# EAGLE design TOP_pcb_redonda_intento_taladros (EAGLE 9.6.2)
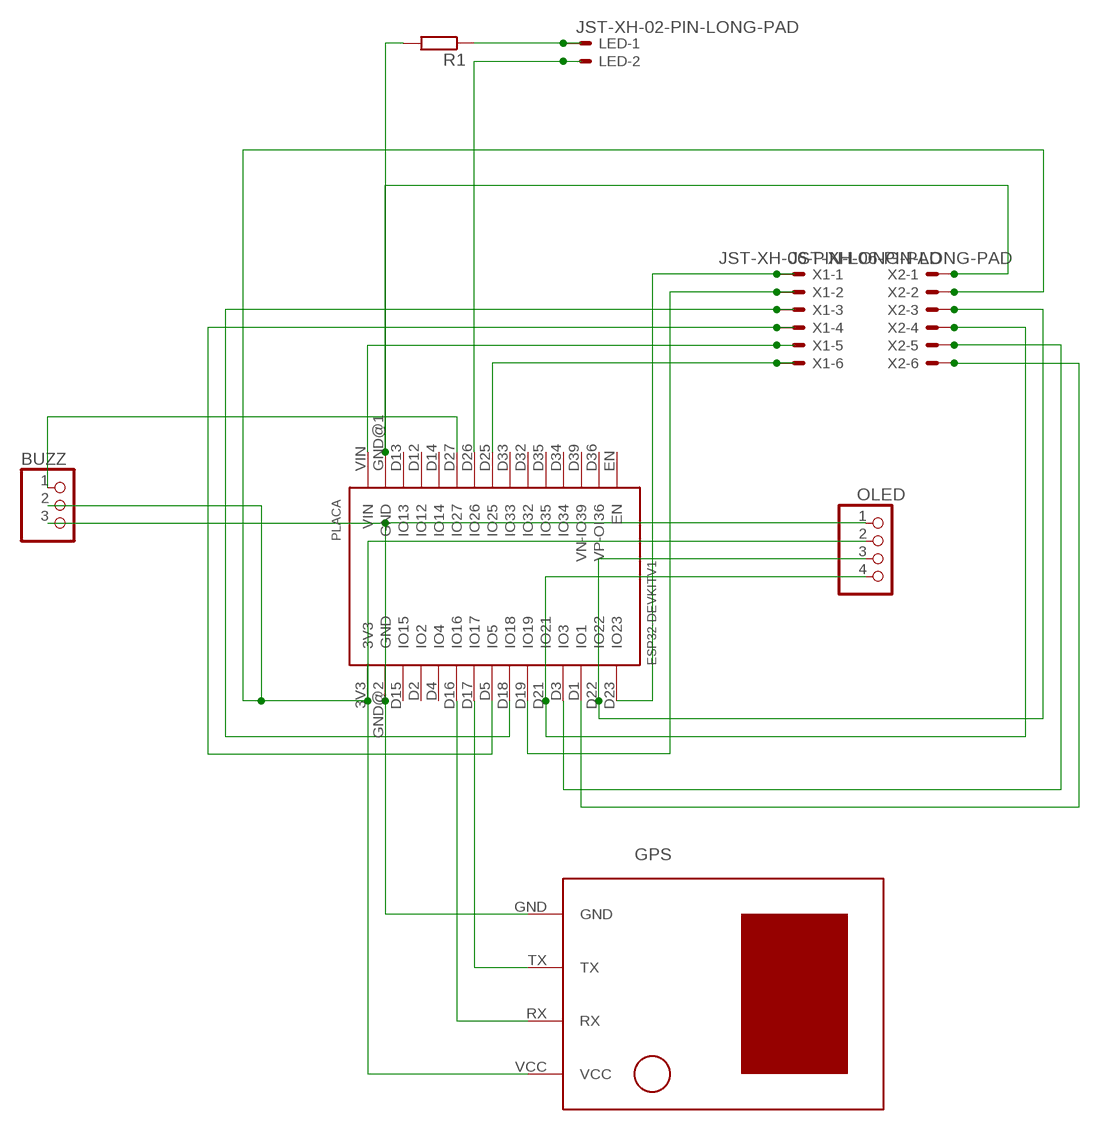
[diagram p0: schematic, sheet 1]

## Parts
BUZZ  PINHD-1X3  [1X03]
GPS  U-BLOX-NEO6V2  [U-BLOX-NEO6V2]
LED  JST-XH-02-PIN-LONG-PAD  [JST-XH-02-PACKAGE-LONG-PAD]
OLED  PINHD-1X4  [1X04]
PLACA  ESP32DEVKITV1  [ESP32-DEVKITV1]
R1  R-EU_0207/10  [0207/10]
X1  JST-XH-06-PIN-LONG-PAD  [JST-XH-06-PACKAGE-LONG-PAD]
X2  JST-XH-06-PIN-LONG-PAD  [JST-XH-06-PACKAGE-LONG-PAD]

## Nets
GPS: BUZZ.3 GPS.GND OLED.1 PLACA.GND@2(GND)
N$1: BUZZ.2 GPS.VCC OLED.2 PLACA.3V3 X2.2
N$2: PLACA.GND@1(GND) R1.2 X2.1
N$3: PLACA.VIN X1.5
N$4: OLED.3 PLACA.D22(IO22) X2.3
N$5: OLED.4 PLACA.D21(IO21) X2.4
N$6: PLACA.D3(IO3) X2.5
N$7: PLACA.D1(IO1) X2.6
N$8: GPS.RX PLACA.D16(IO16)
N$9: GPS.TX PLACA.D17(IO17)
N$10: PLACA.D25(IO25) X1.6
N$11: LED.2 PLACA.D26(IO26)
N$12: LED.1 R1.1
N$13: BUZZ.1 PLACA.D27(IO27)
N$14: PLACA.D23(IO23) X1.1
N$15: PLACA.D19(IO19) X1.2
N$16: PLACA.D18(IO18) X1.3
N$17: PLACA.D5(IO5) X1.4
Unconnected: PLACA.D2(IO2) PLACA.D4(IO4) PLACA.D12(IO12) PLACA.D13(IO13) PLACA.D14(IO14) PLACA.D15(IO15) PLACA.D32(IO32) PLACA.D33(IO33) PLACA.D34(IO34) PLACA.D35(IO35) PLACA.D36(VP-OI36) PLACA.D39(VN-IO39) PLACA.EN

## Library data of the parts
BUZZ = pinhead:PINHD-1X3: PIN HEADER
GPS = u-blox neo-6m v2:U-BLOX-NEO6V2
LED = Rembrandt Electronics - JST XH Connectors v1-0:JST-XH-02-PIN: JST XH Connector 2 Pin Wire to board connector. Pitch: 2,54 mm, (0.100") Number of pins: 2 Created by Rembrandt Electronics www.rembrandtelectronics.com
OLED = pinhead:PINHD-1X4: PIN HEADER
PLACA = ESP32-DEVKITV1:ESP32DEVKITV1
R1 = rcl:R-EU_: RESISTOR, European symbol; SPICEPREFIX: R
X1 X2 = Rembrandt Electronics - JST XH Connectors v1-0:JST-XH-06-PIN: JST XH Connector 2 Pin Wire to board connector. Pitch: 2,54 mm, (0.100") Number of pins: 6 Created by Rembrandt Electronics www.rembrandtelectronics.com

## Board
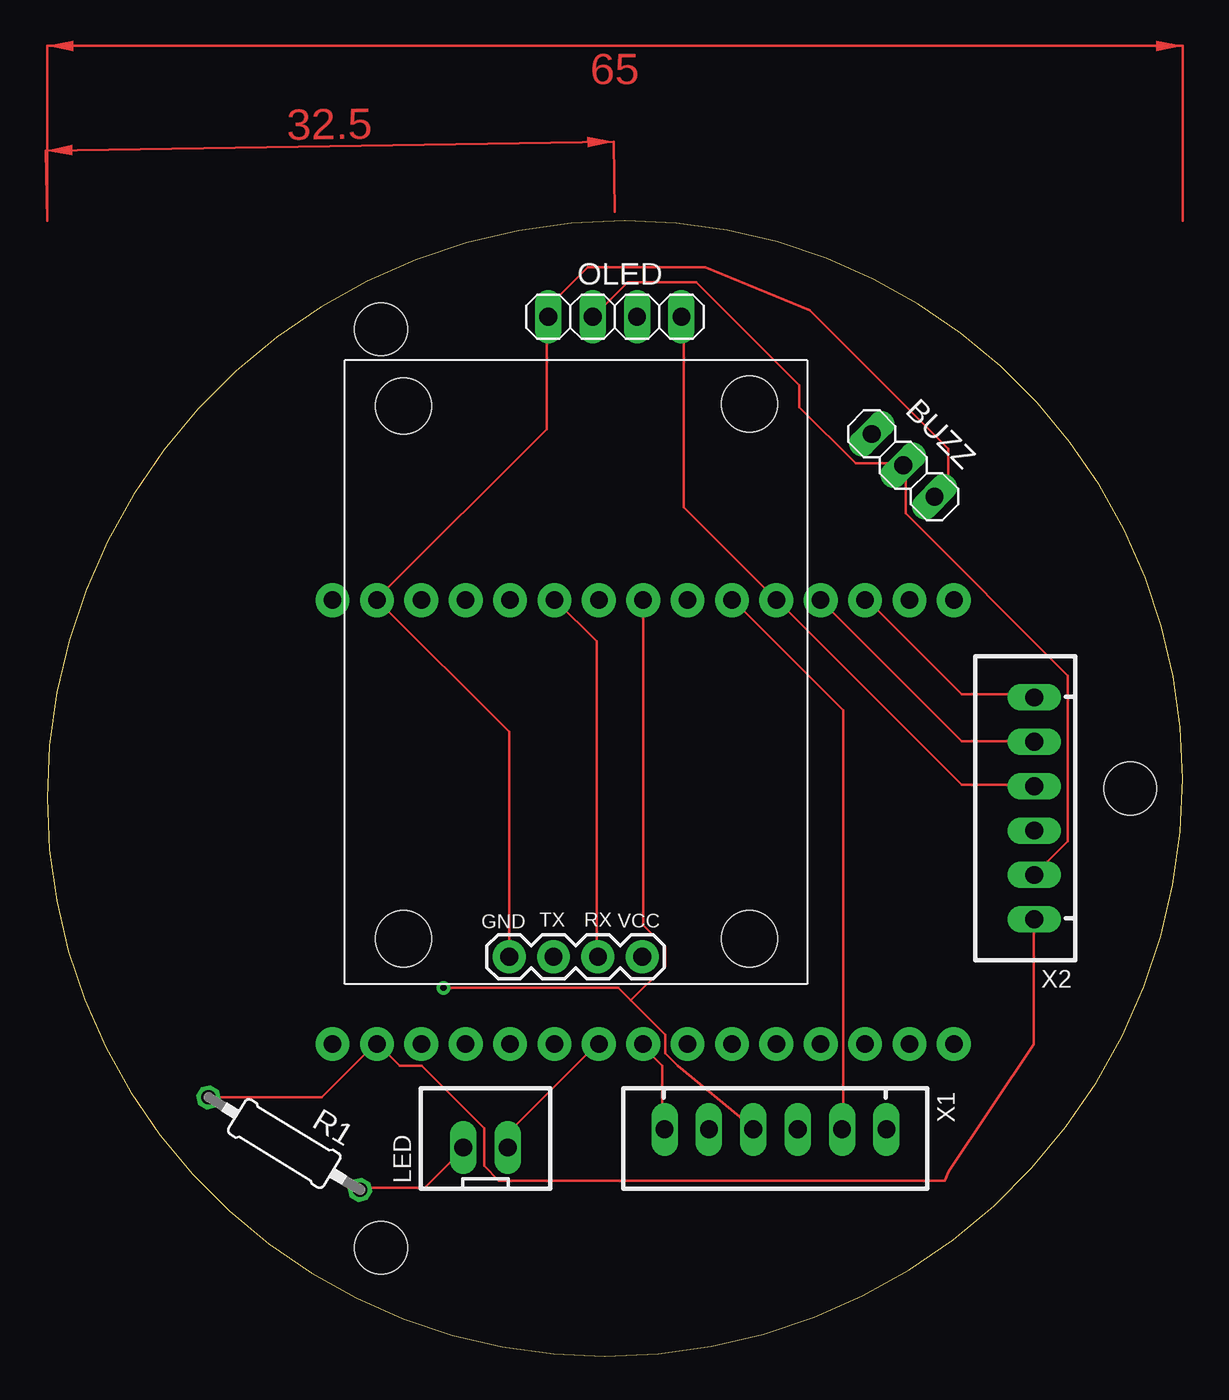
[diagram p1: board, top side]
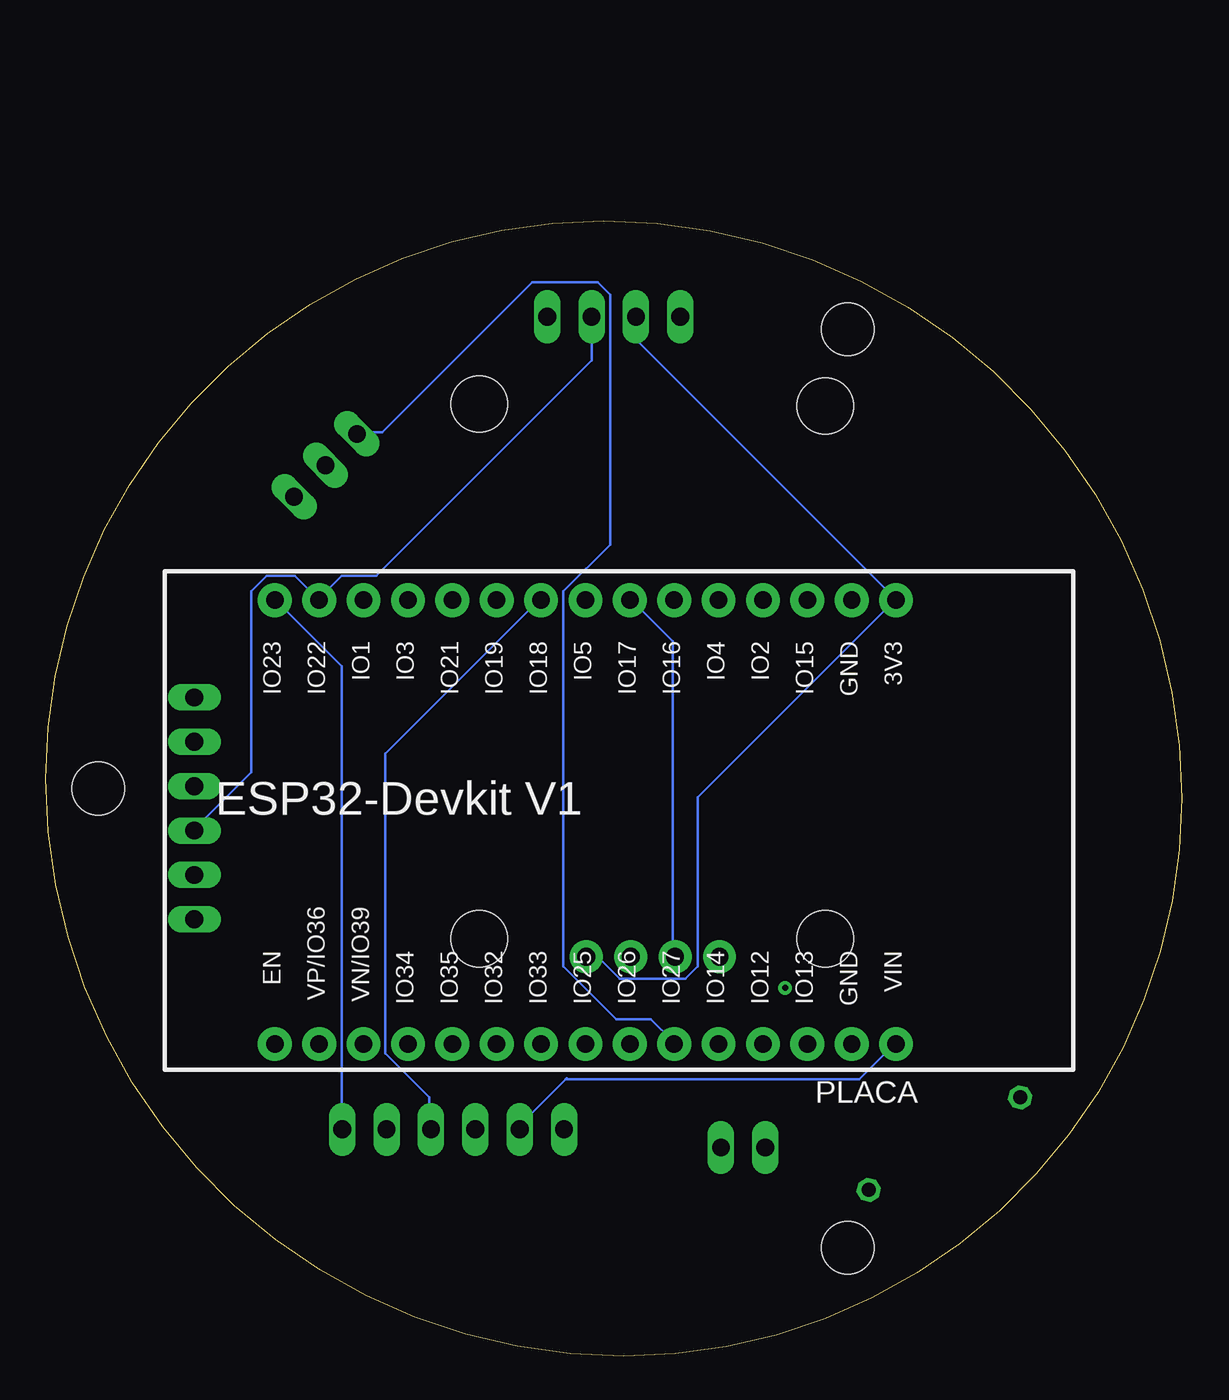
[diagram p2: board, bottom side, seen from below]

Size 65 x 65 mm. Coordinates in mm from the lower left corner, seen from the top.
Outline: 0,31.93 arc90 31.93,0 arc90 65,33.06 arc90 33.06,65 arc90 0,31.93
Copper layers (1*16): Top 0.035mm / dielectric 1.5mm / Bottom 0.035mm
Design rules "default": minimum track width 6mil, minimum drill 0.35mm, track to track 6mil, track to pad 6mil, pad to pad 6mil, via to via 6mil, smd to smd 6mil, copper to edge 40mil, drill to drill 6mil, minimum pad ring 10mil, minimum via ring 8mil, stop-mask expansion 4mil, vias tented up to drill 0mil, thermal gap 10mil
Holes 3 mm at 62,32.5 19.11,58.79 19.11,6.21

### Footprints (pad centres in the part's own frame; a part is rotated, then mirrored left to right if it is on the bottom)
1X03 = drill 1.016 long: 1 -2.54,0; 2 0,0; 3 2.54,0
U-BLOX-NEO6V2 = drill 1.016 pad 1.88: GND 17.05,34.13; RX 11.97,34.13; TX 14.51,34.13; VCC 9.43,34.13 | hole 3.2: 3.3,33.1; 23.1,33.1; 3.3,2.5; 23.1,2.6
JST-XH-02-PACKAGE-LONG-PAD = drill 1.016 long: 1 -1.27,0; 2 1.27,0
1X04 = drill 1.016 long: 1 -3.81,0; 2 -1.27,0; 3 1.27,0; 4 3.81,0
ESP32-DEVKITV1 = drill 1 pad 1.93: 3V3 -16.52,-12.27; D1 13.96,-12.27; D2 -8.9,-12.27; D3 11.42,-12.27; D4 -6.36,-12.27; D5 1.26,-12.27; D12 -8.9,13.135; D13 -11.44,13.135; D14 -6.36,13.135; D15 -11.44,-12.27; D16 -3.82,-12.27; D17 -1.28,-12.27; D18 3.8,-12.27; D19 6.34,-12.27; D21 8.88,-12.27; D22 16.5,-12.27; D23 19.04,-12.27; D25 1.26,13.135; D26 -1.28,13.135; D27 -3.82,13.135; D32 6.34,13.135; D33 3.8,13.135; D34 11.42,13.135; D35 8.88,13.135; D36 16.5,13.135; D39 13.96,13.135; EN 19.04,13.135; GND@1 -13.98,13.135; GND@2 -13.98,-12.27; VIN -16.52,13.135
0207/10 = drill 0.813 octagon: 1 -5.08,0; 2 5.08,0
JST-XH-06-PACKAGE-LONG-PAD = drill 1.016 long: 1 -6.35,0; 2 -3.81,0; 3 -1.27,0; 4 1.27,0; 5 3.81,0; 6 6.35,0

### Placement (x,y rotation side)
BUZZ  49,51 315 top
GPS  43.5,57 180 top
LED  25.1,11.95 0 top
OLED  32.5,59.5 0 top
PLACA  32.86,31.01 180 bottom
R1  13.58,12.17 148.6 top
X1  41.69,12.99 180 top
X2  56.51,31.36 90 top

### Tracks (layer width: path | path; a pad name or v marks a point on that pad's centre or on a via)
GPS
  Top 0.152: BUZZ.3 51.58,49.98 51.58,51.94 43.66,59.86 37.68,62.34 30.95,62.34 28.69,60.07 OLED.1 28.59,59.33 28.59,53.07 18.94,43.42 PLACA.GND@2 18.94,43.24 26.45,35.74 GPS.GND
N$1
  Top 0.152: OLED.2 31.27,59.51 33.24,61.47 37.17,61.47 43.07,55.58 43.07,54.33 46.28,51.11 48.96,51.11 BUZZ.2 49.14,50.93 49.14,48.25 58.44,38.96 58.44,29.48 56.65,27.7 X2.2
  Bottom 0.152: OLED.2 31.09,59.33 31.09,58.08 16.44,43.42 PLACA.3V3 16.44,43.24 27.7,31.99 27.7,22.34 28.41,21.62 32.17,21.62 33.24,22.7 33.95,22.7 GPS.VCC
N$2
  Top 0.152: R1.2 9.29,14.83 15.73,14.83 18.76,17.87 PLACA.GND@1 18.94,17.87 20.19,16.62 21.44,16.62 25.02,13.04 25.02,10.9 25.86,10.05 51.39,10.05 51.61,10.59 56.47,17.87 56.47,24.84 X2.1
N$3
  Bottom 0.152: 35.2,15.86 18.45,15.86 16.44,17.87 PLACA.VIN | 35.2,15.86 35.25,15.86 | X1.5 37.71,13.04 37.71,13.4 35.2,15.9 35.2,15.86
N$4
  Bottom 0.152: OLED.3 33.77,59.33 33.77,57.01 46.1,44.67 48.07,44.67 49.32,43.42 PLACA.D22 49.5,43.42 50.75,44.67 52.36,44.67 53.25,43.78 53.25,33.42 56.47,30.2 X2.3
N$5
  Top 0.152: X2.4 56.47,32.7 52.36,32.7 41.82,43.24 PLACA.D21 41.64,43.42 36.45,48.61 36.45,59.33 OLED.4
N$6
  Top 0.152: X2.5 56.47,35.2 52.36,35.2 44.32,43.24 PLACA.D3
N$7
  Top 0.152: X2.6 56.47,37.88 52.36,37.88 47,43.24 PLACA.D1
N$8
  Top 0.152: GPS.RX 31.45,22.87 31.45,40.92 29.13,43.24 PLACA.D16
N$9
  Bottom 0.152: GPS.TX 29.13,22.87 29.13,40.92 31.45,43.24 PLACA.D17
N$10
  Top 0.152: 34.12,17.7 PLACA.D25 34.13,17.69 35.2,16.62 35.2,13.04 X1.6
N$11
  Top 0.152: LED.2 26.45,11.97 26.45,12.87 31.45,17.87 PLACA.D26
N$12
  Top 0.152: R1.1 18.05,9.65 21.62,9.65 23.77,11.79 LED.1
N$13
  Bottom 0.152: BUZZ.1 47.18,52.9 45.75,52.9 37.17,61.47 33.42,61.47 32.7,60.76 32.7,46.46 35.38,43.78 35.38,22.34 32.34,19.3 30.38,19.3 29.13,18.05 PLACA.D27
N$14
  Bottom 0.152: PLACA.D23 51.82,43.24 48.07,39.49 48.07,17.33 48.07,15.55 48.07,13.04 X1.1
N$15
  Top 0.152: PLACA.D19 39.31,43.24 45.57,36.99 45.57,17.33 45.57,15.55 45.57,13.04 X1.2
N$16
  Bottom 0.152: PLACA.D18 36.81,43.24 45.57,34.49 45.57,17.33 43.07,14.83 43.07,13.04 X1.3
N$17  (via drill 0.35)
  Top 0.152: v22.7,21.09 32.7,21.09 33.42,20.37 | 33.42,20.37 35.38,18.41 35.38,17.33 36.1,16.62 40.13,13.31 X1.4 | 33.42,20.37 35.38,22.34 35.38,23.41 34.13,24.66 34.13,43.24 PLACA.D5
(copper drawn outside any net)
  shapes: Top area x2